# EAGLE design ledmaster (EAGLE 5.11)
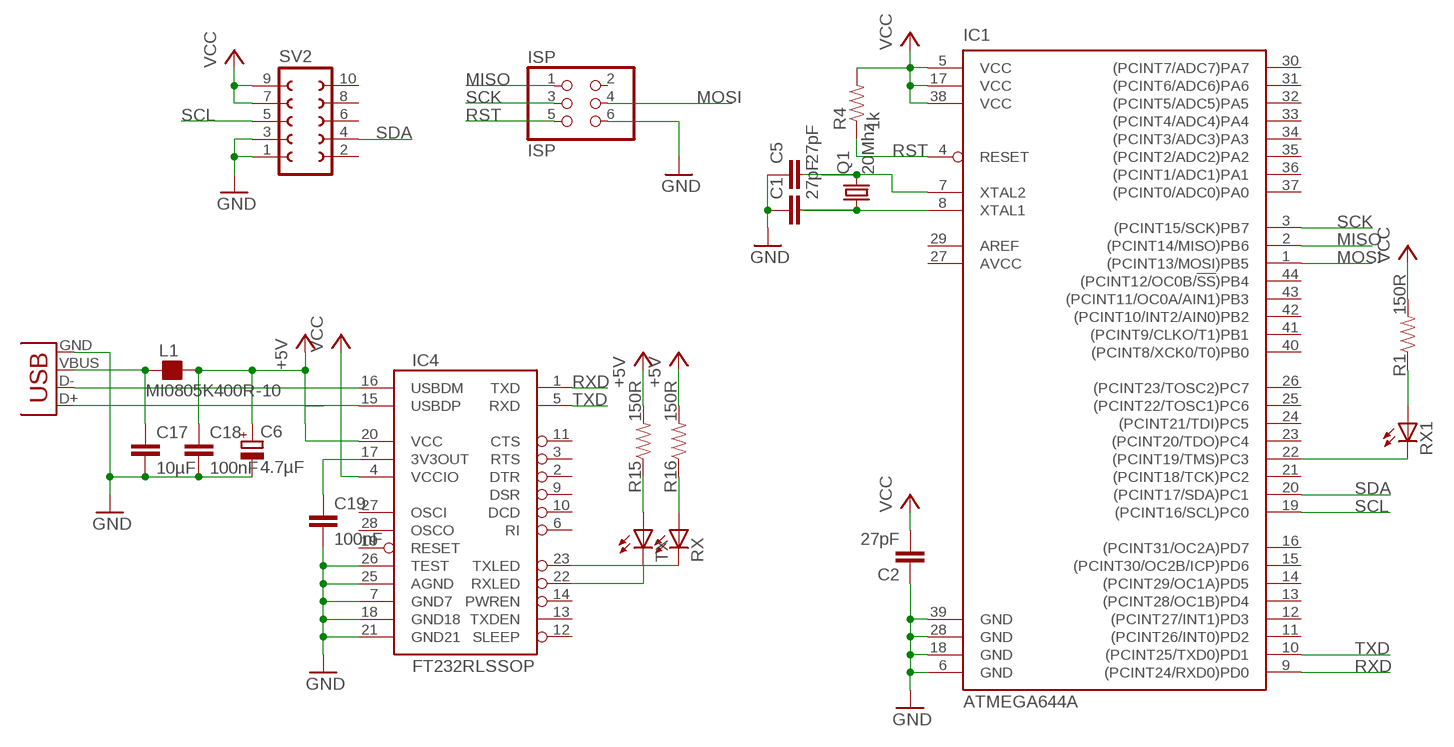
[diagram p0: schematic, sheet 1]

## Parts
C1  27pF  CAP0805  [0805]
C2  27pF  CAP0805  [0805]
C5  27pF  CAP0805  [0805]
C6  4.7µF  CPOL-EUSMCC  [SMC_C]
C17  10µF  CAP0805  [0805]
C18  100nF  CAP0805  [0805]
C19  100nF  CAP0805  [0805]
IC1  ATMEGA644A  [TQFP44]
IC4  FT232RLSSOP  [SSOP28DB]
ISP  ISP  PINHD-2X03_2.54  [2X03]
L1  MI0805K400R-10  FB_0805  [L0805]
Q1  20Mhz  CRYSTALCTS406  [CTS406]
R1  150R  RESISTOR  [0805]
R4  1k  RESISTOR  [0805]
R15  150R  RESISTOR  [0805]
R16  150R  RESISTOR  [0805]
RX  LEDCHIP-LED0805  [CHIP-LED0805]
RX1  LEDCHIP-LED0805  [CHIP-LED0805]
SV2  FE05-2W  [FE05-2W]
TX  LEDCHIP-LED0805  [CHIP-LED0805]
X1  USB-SMD-NS  [USB-MINIB-NOSTOP]

## Nets
+5V: C6.+ C18.1 IC4.20(VCC) L1.2 R15.2 R16.2
GND: C1.1 C2.1 C5.1 C6.- C17.2 C18.2 C19.2 IC1.6(GND) IC1.18(GND) IC1.28(GND) IC1.39(GND) IC4.7(GND7) IC4.18(GND18) IC4.21(GND21) IC4.25(AGND) IC4.26(TEST) ISP.6 SV2.1 SV2.3 X1.GND
MISO: IC1.2((PCINT14/MISO)PB6) ISP.1
MOSI: IC1.1((PCINT13/MOSI)PB5) ISP.4
N$1: IC4.16(USBDM) X1.D-
N$2: IC4.15(USBDP) X1.D+
N$4: C17.1 L1.1 X1.VBUS
N$5: R1.1 RX1.A
N$6: IC1.22((PCINT19/TMS)PC3) RX1.C
N$19: R15.1 TX.A
N$20: R16.1 RX.A
N$27: IC4.22(RXLED) TX.C
N$28: IC4.23(TXLED) RX.C
N$29: C19.1 IC4.17(3V3OUT)
N$30: C5.2 IC1.7(XTAL2) Q1.3
N$32: C1.2 IC1.8(XTAL1) Q1.1
RST: IC1.4(RESET) ISP.5 R4.1
RXD: IC1.9((PCINT24/RXD0)PD0) IC4.1(TXD)
SCK: IC1.3((PCINT15/SCK)PB7) ISP.3
SCL: IC1.19((PCINT16/SCL)PC0) SV2.5
SDA: IC1.20((PCINT17/SDA)PC1) SV2.4
TXD: IC1.10((PCINT25/TXD0)PD1) IC4.5(RXD)
VCC: C2.2 IC1.5(VCC) IC1.17(VCC) IC1.38(VCC) IC4.4(VCCIO) R1.2 R4.2 SV2.7 SV2.9
Unconnected: IC1.11((PCINT26/INT0)PD2) IC1.12((PCINT27/INT1)PD3) IC1.13((PCINT28/OC1B)PD4) IC1.14((PCINT29/OC1A)PD5) IC1.15((PCINT30/OC2B/ICP)PD6) IC1.16((PCINT31/OC2A)PD7) IC1.21((PCINT18/TCK)PC2) IC1.23((PCINT20/TDO)PC4) IC1.24((PCINT21/TDI)PC5) IC1.25((PCINT22/TOSC1)PC6) IC1.26((PCINT23/TOSC2)PC7) IC1.29(AREF) IC1.30((PCINT7/ADC7)PA7) IC1.31((PCINT6/ADC6)PA6) IC1.32((PCINT5/ADC5)PA5) IC1.33((PCINT4/ADC4)PA4) IC1.34((PCINT3/ADC3)PA3) IC1.35((PCINT2/ADC2)PA2) IC1.36((PCINT1/ADC1)PA1) IC1.37((PCINT0/ADC0)PA0) IC1.40((PCINT8/XCK0/T0)PB0) IC1.41((PCINT9/CLKO/T1)PB1) IC1.42((PCINT10/INT2/AIN0)PB2) IC1.43((PCINT11/OC0A/AIN1)PB3) IC1.44((PCINT12/OC0B/!SS!)PB4) IC4.2(DTR) IC4.3(RTS) IC4.6(RI) IC4.9(DSR) IC4.10(DCD) IC4.11(CTS) IC4.12(SLEEP) IC4.13(TXDEN) IC4.14(PWREN) IC4.19(RESET) IC4.27(OSCI) IC4.28(OSCO) ISP.2 SV2.2 SV2.6 SV2.8 SV2.10

## Power pins joined to a net without a drawn wire
AVCC: IC1.27(AVCC)

## Library data of the parts
C1 C2 C5 C17-C19 = SparkFun:CAP: Capacitor Standard 0603 ceramic capacitor, and 0.1" leaded capacitor.
C6 = resistor:CPOL-EU: POLARIZED CAPACITOR, European symbol
IC1 = atmel:ATMEGA644: 8-bit Microcontroller with 64K Bytes In-System Programmable Flash Source: http://www.atmel.com/dyn/resources/prod_documents/doc2593.pdf; MPN: ATMEGA644PV-10AU; OC_FARNELL: 1455123; OC_NEWARK: 58M3748
IC4 = SparkFun:FT232RL: USB UART FT232RL 4th Generation USB UART (USB <-> Serial) Controller. Spark Fun Electronics SKU : COM-00650
ISP = pinhead-2:PINHD-2X03: PIN HEADER
L1 = rc-master-smd:FB_: FERRITE BEAD
Q1 = crystal:CRYSTAL: CRYSTAL
R1 R4 R15 R16 = SparkFun:RESISTOR: Resistor Basic schematic elements and footprints for 0603, 1206, and PTH 1/10th watt (small) resistors.
RX RX1 TX = led:LED: LED OSRAM: - CHIPLED LG R971, LG N971, LY N971, LG Q971, LY Q971, LO R971, LY R971 LH N974, LH R974 LS Q976, LO Q976, LY Q976 LO Q996 - Hyper CHIPLED LW Q18S LB Q993, LB Q99A, LB R99A - SideLED LS A670, LO A670, LY A670, LG A670, LP A670 LB A673, LV A673, LT A673, LW A673 LH A674 LY A675 LS A676, LA A676, LO A676, LY A676, LW A676 LS A679, LY A679, LG A679 - Hyper Micro SIDELED® LS Y876, LA Y876, LO Y876, LY Y876 LT Y87S - SmartLED LW L88C, LW L88S LB L89C, LB L89S, LG L890 LS L89K, LO L89K, LY L89K LS L896, LA L896, LO L896, LY L896 - TOPLED LS T670, LO T670, LY T670, LG T670, LP T670 LSG T670, LSP T670, LSY T670, LOP T670, LYG T670 LG T671, LOG T671, LSG T671 LB T673, LV T673, LT T673, LW T673 LH T674 LS T676, LA T676, LO T676, LY T676, LB T676, LH T676, LSB T676, LW T676 LB T67C, LV T67C, LT T67C, LS T67K, LO T67K, LY T67K, LW E67C LS E67B, LA E67B, LO E67B, LY E67B, LB E67C, LV E67C, LT E67C LW T67C LS T679, LY T679, LG T679 LS T770, LO T770, LY T770, LG T770, LP T770 LB T773, LV T773, LT T773, LW T773 LH T774 LS E675, LA E675, LY E675, LS T675 LS T776, LA T776, LO T776, LY T776, LB T776 LHGB T686 LT T68C, LB T68C - Hyper Mini TOPLED® LB M676 - Mini TOPLED Santana® LG M470 LS M47K, LO M47K, LY M47K Source: http://www.osram.convergy.de LUXEON: - LUMILED® LXK2-PW12-R00, LXK2-PW12-S00, LXK2-PW14-U00, LXK2-PW14-V00 LXK2-PM12-R00, LXK2-PM12-S00, LXK2-PM14-U00 LXK2-PE12-Q00, LXK2-PE12-R00, LXK2-PE12-S00, LXK2-PE14-T00, LXK2-PE14-U00 LXK2-PB12-K00, LXK2-PB12-L00, LXK2-PB12-M00, LXK2-PB14-N00, LXK2-PB14-P00, LXK2-PB14-Q00 LXK2-PR12-L00, LXK2-PR12-M00, LXK2-PR14-Q00, LXK2-PR14-R00 LXK2-PD12-Q00, LXK2-PD12-R00, LXK2-PD12-S00 LXK2-PH12-R00, LXK2-PH12-S00 LXK2-PL12-P00, LXK2-PL12-Q00, LXK2-PL12-R00 Source: www.luxeon.com KINGBRIGHT: KA-3528ASYC Source: www.kingbright.com
SV2 = con-lsta:FE05-2W: FEMALE HEADER
X1 = SparkFun:USB: USB Connectors USB-B-PTH is fully proven SKU : PRT-00139 USB-miniB is fully proven SKU : PRT-00587 USB-A-PCB is untested. USB-A-H is throughly reviewed, but untested. Spark Fun Electronics SKU : PRT-00437 USB-B-SMT is throughly reviewed, but untested. Needs silkscreen touching up. USB-A-S has not been used/tested USB-MB-H has not been used/tested

## Board
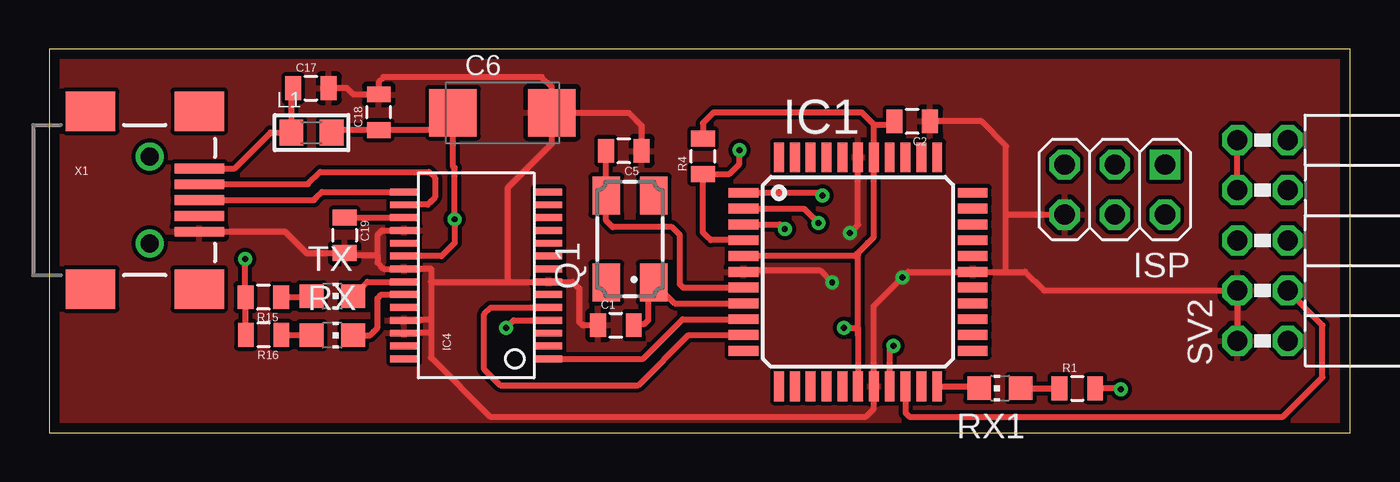
[diagram p1: board, top side]
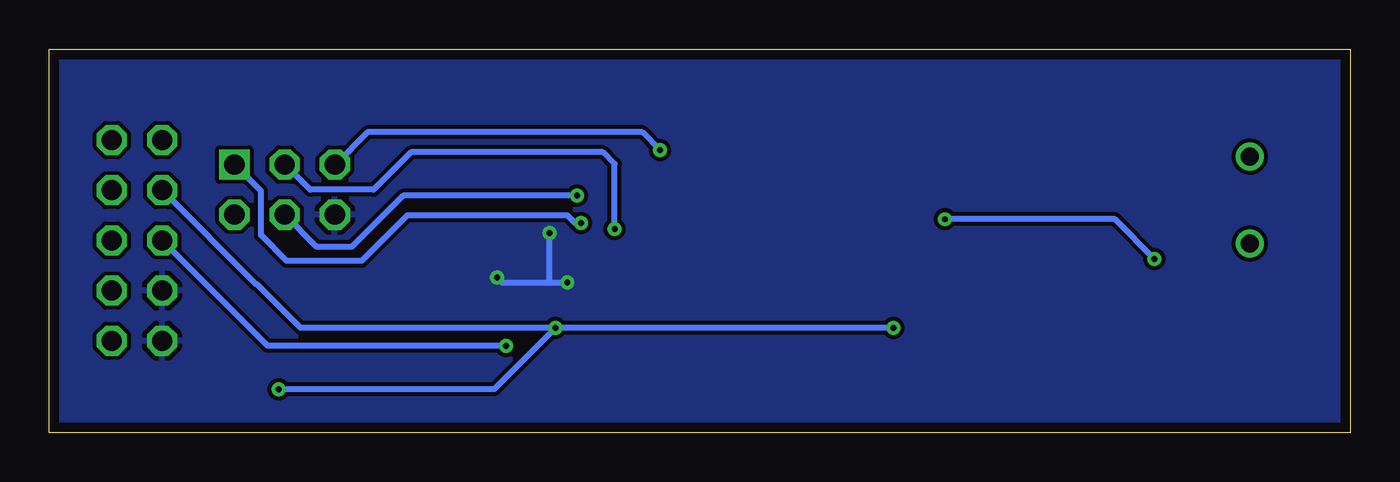
[diagram p2: board, bottom side, seen from below]

Size 65.8 x 19.4 mm. Coordinates in mm from the lower left corner, seen from the top.
Outline: 0,0 65.8,0 65.8,19.4 0,19.4 0,0
Copper layers (1*16): Top 0.035mm / dielectric 1.5mm / Bottom 0.035mm
Design rules "default *": minimum track width 10mil, minimum drill 0.3mm, track to track 8mil, track to pad 8mil, pad to pad 8mil, via to via 8mil, smd to smd 8mil, copper to edge 20mil, drill to drill 8mil, minimum pad ring 10mil, minimum via ring 8mil, stop-mask expansion 4mil, vias tented up to drill 30mil, thermal gap 10mil

### Footprints (pad centres in the part's own frame; a part is rotated, then mirrored left to right if it is on the bottom)
0805 = smd 0.8 x 1.2: 1 -0.9,0; 2 0.9,0
SMC_C = smd 2.4 x 2.4: + -2.5,0; - 2.5,0
TQFP44 = smd 1.5 x 0.5: 1 -5.8,4; 2 -5.8,3.2; 3 -5.8,2.4; 4 -5.8,1.6; 5 -5.8,0.8; 6 -5.8,0; 7 -5.8,-0.8; 8 -5.8,-1.6; 9 -5.8,-2.4; 10 -5.8,-3.2; 11 -5.8,-4; 23 5.8,-4; 24 5.8,-3.2; 25 5.8,-2.4; 26 5.8,-1.6; 27 5.8,-0.8; 28 5.8,0; 29 5.8,0.8; 30 5.8,1.6; 31 5.8,2.4; 32 5.8,3.2; 33 5.8,4 | smd 0.5 x 1.5: 12 -4,-5.8; 13 -3.2,-5.8; 14 -2.4,-5.8; 15 -1.6,-5.8; 16 -0.8,-5.8; 17 0,-5.8; 18 0.8,-5.8; 19 1.6,-5.8; 20 2.4,-5.8; 21 3.2,-5.8; 22 4,-5.8; 34 4,5.8; 35 3.2,5.8; 36 2.4,5.8; 37 1.6,5.8; 38 0.8,5.8; 39 0,5.8; 40 -0.8,5.8; 41 -1.6,5.8; 42 -2.4,5.8; 43 -3.2,5.8; 44 -4,5.8
SSOP28DB = smd 0.348 x 1.397: 1 -4.225,-3.656; 2 -3.575,-3.656; 3 -2.925,-3.656; 4 -2.275,-3.656; 5 -1.625,-3.656; 6 -0.975,-3.656; 7 -0.325,-3.656; 8 0.325,-3.656; 9 0.975,-3.656; 10 1.625,-3.656; 11 2.275,-3.656; 12 2.925,-3.656; 13 3.575,-3.656; 14 4.225,-3.656; 15 4.225,3.656; 16 3.575,3.656; 17 2.925,3.656; 18 2.275,3.656; 19 1.625,3.656; 20 0.975,3.656; 21 0.325,3.656; 22 -0.325,3.656; 23 -0.975,3.656; 24 -1.625,3.656; 25 -2.275,3.656; 26 -2.925,3.656; 27 -3.575,3.656; 28 -4.225,3.656
2X03 = drill 1.016 square: 1 -2.54,-1.27 | drill 1.016 octagon: 2 -2.54,1.27; 3 0,-1.27; 4 0,1.27; 5 2.54,-1.27; 6 2.54,1.27
L0805 = smd 1.2 x 1.3: 1 -1.016,0; 2 1.016,0
CTS406 = smd 1.9 x 1.4: 1 -2.2,-1.2; 2 2.2,-1.2; 3 2.2,1.2; 4 -2.2,1.2
CHIP-LED0805 = smd 1.2 x 1.2: A 0,-1.05; C 0,1.05
FE05-2W = drill 1.016 octagon: 1 -5.08,1.27; 2 -5.08,-1.27; 3 -2.54,1.27; 4 -2.54,-1.27; 5 0,1.27; 6 0,-1.27; 7 2.54,1.27; 8 2.54,-1.27; 9 5.08,1.27; 10 5.08,-1.27
USB-MINIB-NOSTOP = smd 2.5 x 0.5: D+ 2.5,0; D- 2.5,0.8; GND 2.5,-1.6; ID 2.5,-0.8; VBUS 2.5,1.6 | smd 2.5 x 2: G1 -3,-4.5; G2 -3,4.5; G3 2.5,4.5; G4 2.5,-4.5 | drill 0.9 pad 0.8 round: H1 0,2.2 | drill 0.9 pad 0.787 round: H2 0,-2.2

### Placement (x,y rotation side)
C1  28.66,5.44 0 top
C2  43.65,15.76 180 top
C5  29.06,14.26 180 top
C6  22.92,16.19 0 top
C17  13.23,17.44 0 top
C18  16.66,16.22 90 top
C19  14.94,9.99 270 top
IC1  40.91,8.14 0 top
IC4  21.59,7.96 90 top
ISP  53.9,12.3 180 top
L1  13.26,15.19 0 top
Q1  29.37,9.8 90 top
R1  52,2.24 0 top
R4  33.06,13.99 90 top
R15  10.82,6.86 180 top
R16  10.84,4.95 180 top
RX  14.32,4.93 270 top
RX1  48.08,2.25 90 top
SV2  61.37,9.73 90 top
TX  14.32,6.91 270 top
X1  5.08,11.77 0 top

### Tracks (layer width: path | path; a pad name or v marks a point on that pad's centre or on a via)
+5V  (via drill 0.3)
  Top 0.305: L1.2 14.41,15.32 C18.1 19.65,15.32 C6.+ 20.42,13.48 20.5,13.4 v20.5,10.8 20.5,9.6 19.84,8.93 IC4.20 | 9.94,6.84 R15.2 | R16.2 9.94,6.84 | 9.94,6.84 9.9,6.84 v9.9,8.8
  Bottom 0.305: v9.9,8.8 11.9,10.8 v20.5,10.8
GND  (via drill 0.3)
  Top 0.305: 19.3,7.63 19.3,8.3 17.95,8.3 IC4.21 16.91,8.28 16.6,8.6 16.6,9 | IC4.25 17.95,5.7 19.3,5.7 | C17.2 15.06,17.44 15.38,17.12 C18.2 16.66,17.76 16.9,18 24.9,18 25.42,17.48 C6.- | IC4.18 16.84,10.23 16.6,10 16.6,9 | 19.3,7.63 23.3,7.63 | 23.3,7.63 IC4.7 26.46,7.63 26.8,7.3 26.8,5.6 26.96,5.44 C1.1 | 19.3,7.63 19.3,5.7 | X1.GND 11.93,10.17 13.01,9.09 C19.2 15.03,9 16.6,9 | C5.1 29.96,15.54 29.31,16.19 C6.- | C6.- 25.42,14.62 23.2,12.4 23.2,7.73 23.3,7.63 | IC1.6 35.17,8.2 39,8.2 v39.6,7.6 | IC1.39 40.91,10.51 v40.5,10.1 | 19.3,5.03 19.3,3.8 22.3,0.8 41.3,0.8 41.71,1.21 IC1.18 41.71,6.41 v43.15,7.85 43.44,8.14 IC1.28 48.4,8.14 | 19.3,5.03 IC4.26 | 19.3,5.7 19.3,5.03 | SV2.1 SV2.3 50.31,7.19 49.36,8.14 48.4,8.14 | C2.1 47.14,15.76 48.4,14.5 48.4,11.03 | 48.4,11.03 ISP.6 | 48.4,8.14 48.4,11.03
  Bottom 0.305: 40.6,7.6 42.9,7.6 v43.15,7.85 | 40.6,7.6 v39.6,7.6 | v40.5,10.1 40.5,7.7 40.6,7.6
  pour Top: 0,-0.1 65.8,-0.1 65.8,19.5 0,19.5 0,0
  pour Bottom: 0,19.5 65.8,19.5 65.8,0 0,0
MISO  (via drill 0.3)
  Top 0.305: IC1.2 38.16,11.34 v38.9,10.6
  Bottom 0.305: v38.9,10.6 39.2,10.6 39.6,11 47.7,11 50,8.7 53.8,8.7 55.1,10 55.1,12.23 ISP.1
MOSI  (via drill 0.3)
  Top 0.305: IC1.1 38.96,12.14 v39.1,12
  Bottom 0.305: v39.1,12 47.9,12 50.5,9.4 52.27,9.4 ISP.4
N$1
  Top 0.305: X1.D- 13.07,12.57 13.7,13.2 19.2,13.2 19.5,12.9 19.5,11.9 19.3,11.7 19.14,11.53 IC4.16
N$2
  Top 0.305: IC4.15 13.79,12.18 13.5,11.9 13.37,11.77 X1.D+
N$4
  Top 0.305: X1.VBUS 9.37,13.37 10.5,14.5 11.19,15.19 L1.1 12.24,17.35 C17.1
N$5
  Top 0.305: RX1.A R1.1
N$6
  Top 0.305: RX1.C 46.94,2.34 IC1.22
N$19
  Top 0.305: TX.A 13.22,6.86 R15.1
N$20
  Top 0.305: RX.A 13.25,4.95 R16.1
N$27
  Top 0.305: IC4.22 16.09,7.63 TX.C
N$28
  Top 0.305: IC4.23 16.79,6.98 16.6,6.8 16.6,5.3 16.4,5.1 16.23,4.93 RX.C
N$29
  Top 0.305: IC4.17 C19.1
N$30
  Top 0.305: IC1.7 32.06,7.34 31.9,7.5 31.9,10 31.5,10.4 28.5,10.4 28.17,10.73 Q1.3 28.17,14.07 C5.2
N$32
  Top 0.305: IC1.8 31.63,6.54 Q1.1 30.07,7.13 30.3,6.9 30.3,5.7 30.1,5.5 29.62,5.5 C1.2
RST  (via drill 0.3)
  Top 0.305: IC1.4 33.46,9.74 33.3,9.9 33.06,10.14 R4.1 34.4,13.1 34.9,13.6 v34.9,14.3
  Bottom 0.305: ISP.5 51.33,13.57 49.7,15.2 35.8,15.2 v34.9,14.3
RXD
  Top 0.305: IC1.9 32.04,5.74 30.04,3.73 IC4.1
SCK  (via drill 0.3)
  Top 0.305: v37.2,10.3 36.94,10.54 IC1.3
  Bottom 0.305: ISP.3 53.87,13.57 52.6,12.3 49.4,12.3 47.5,14.2 37.8,14.2 37.2,13.6 v37.2,10.3
SCL  (via drill 0.3)
  Top 0.305: IC1.19 42.51,4.21 v42.7,4.4
  Bottom 0.305: v42.7,4.4 45.4,4.4 54.77,4.4 SV2.5
SDA
  Top 0.305: IC1.20 43.31,0.99 43.5,0.8 62.4,0.8 64.4,2.8 64.4,5.43 SV2.4
TXD
  Top 0.305: IC4.5 22.34,6.34 22,6 22,3.2 22.8,2.4 29.8,2.4 32.34,4.94 IC1.10
VCC  (via drill 0.3)
  Top 0.305: R4.2 33.06,15.66 33.6,16.2 41.1,16.2 41.6,15.7 41.71,15.59 | 41.71,15.59 IC1.38 41.71,9.91 41.4,9.6 40.85,9.05 | IC1.5 40.74,8.94 40.85,9.05 | 40.91,4.9 IC1.17 | 40.91,4.9 40.91,8.99 40.85,9.05 | IC4.4 23.48,5.68 v23.1,5.3 | C2.2 42.58,15.59 41.71,15.59 | v40.2,5.3 40.91,5.3 40.91,4.9 | SV2.7 60.1,12.1 SV2.9 | R1.2 54.16,2.24 v54.2,2.2
  Bottom 0.305: v23.1,5.3 v40.2,5.3 | v40.2,5.3 53.1,5.3 | 53.1,5.3 55.3,7.5 55.33,7.5 SV2.7 | v40.2,5.3 53.1,5.3 | v54.2,2.2 43.3,2.2 v40.2,5.3

### Text on the board
tStop: LED-Master seb@exse.net <<</>> | VCC | GND
bStop: VCC | GND | LED-Master seb@exse.net <<</>>